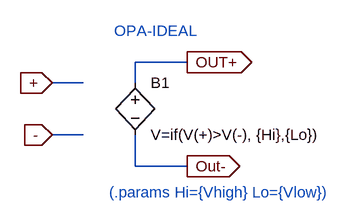
[diagram p0: schematic OPA-IDEAL.asc]
OPA-IDEAL.asc, the LTspice schematic file:
Version 4
SHEET 1 880 680
WIRE 224 128 144 128
WIRE 64 160 16 160
WIRE 144 160 144 128
WIRE 64 240 16 240
WIRE 144 288 144 240
WIRE 224 288 144 288
FLAG 16 160 +
IOPIN 16 160 In
FLAG 224 128 OUT+
IOPIN 224 128 Out
FLAG 16 240 -
IOPIN 16 240 In
FLAG 224 288 Out-
IOPIN 224 288 Out
SYMBOL bv 144 144 R0
SYMATTR InstName B1
SYMATTR Value V=if(V(+)>V(-), {Hi},{Lo})
TEXT 104 328 Left 0 ;(.params Hi={Vhigh} Lo={Vlow})
TEXT 112 80 Left 0 ;OPA-IDEAL

The netlist it stands for:
* OPA-IDEAL.asc
B1 OUT+ Out- V=if(V(+)>V(-), {Hi},{Lo})
* (.params Hi={Vhigh} Lo={Vlow})
* OPA-IDEAL
.backanno
.end